# Altium schematic sheet HIVE_SIGHT_WROOM.SchDoc
size Tabloid; Sheet_Name: WROOM; Size: 11x17
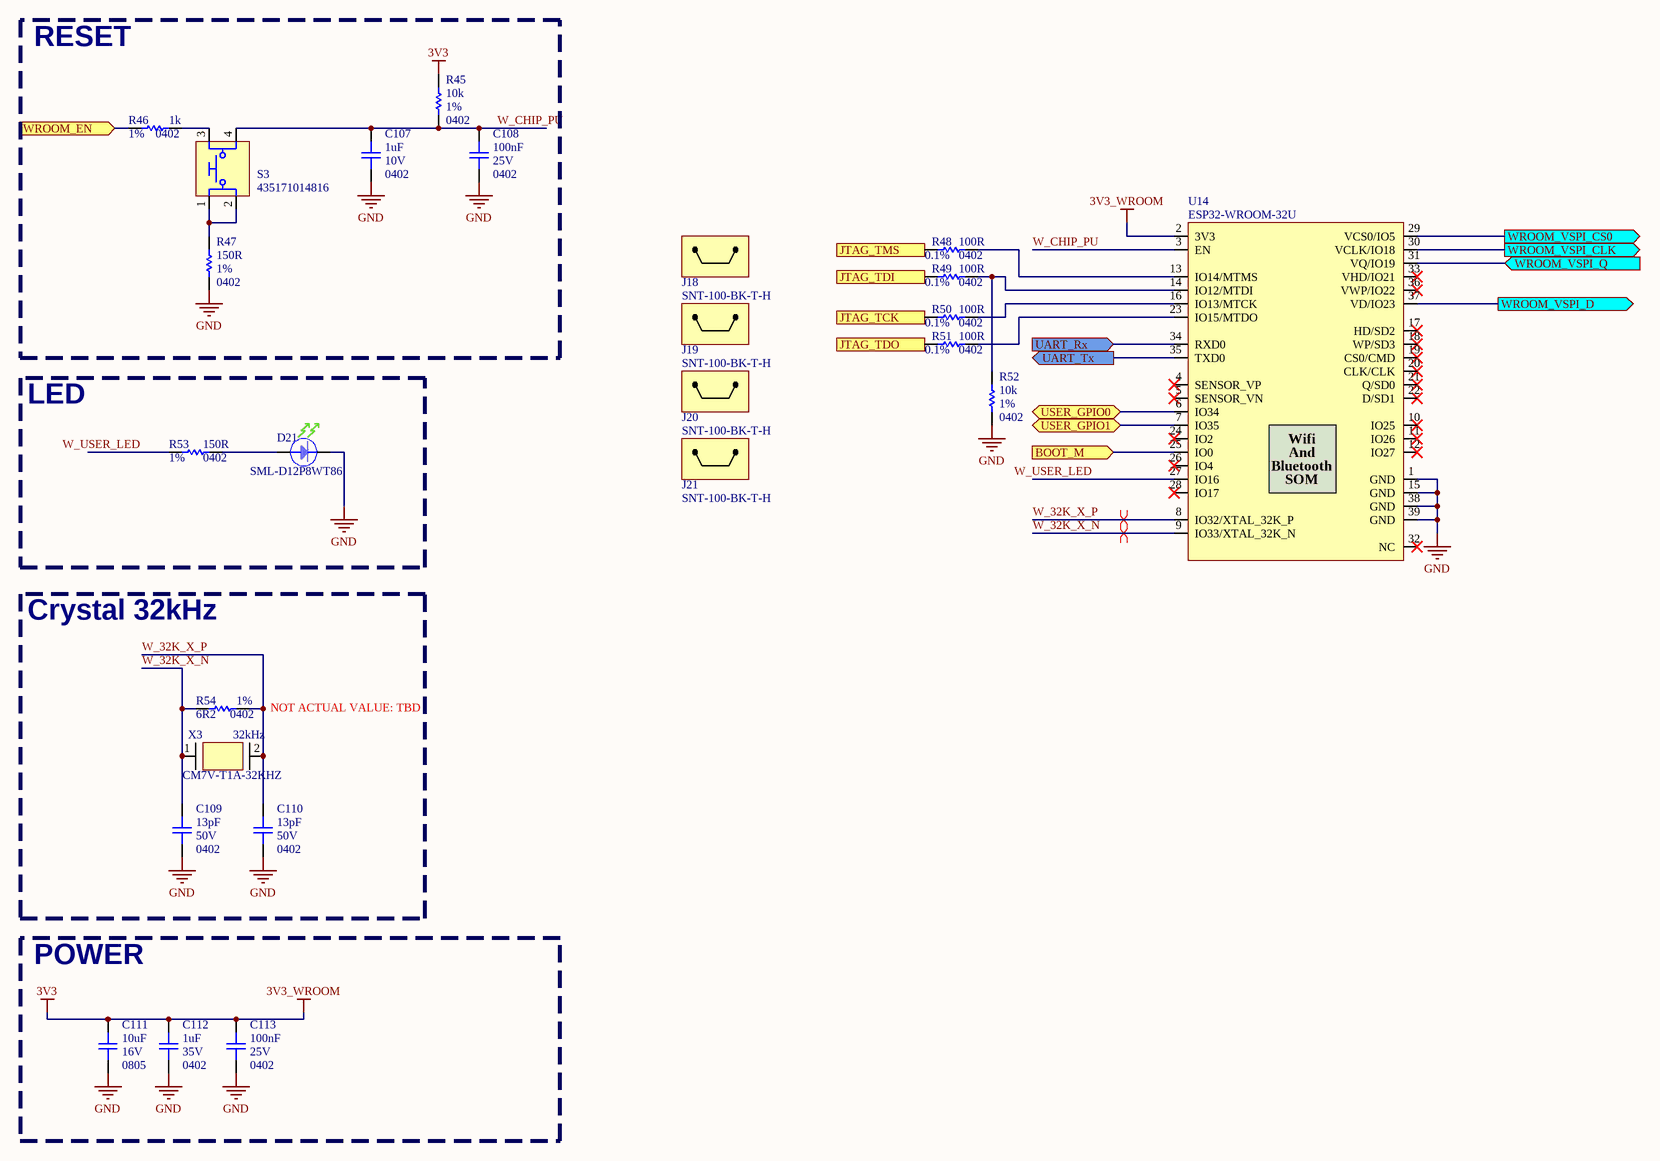
[diagram p0: HIVE_SIGHT_WROOM.SchDoc]

## Parts
C107  value 1uF  Package: 0402  Voltage Rating: 10V  [CAP_CER_0402]  (hidden comment: CL05A105MP5NNNC)
C108  value 100nF  Package: 0402  Voltage Rating: 25V  [CAP_CER_0402]  (hidden comment: CL05A104KA5NNNC)
C109  value 13pF  Package: 0402  Voltage Rating: 50V  [CAP_CER_0402]  (hidden comment: CC0402JRNPO9BN130)
C110  value 13pF  Package: 0402  Voltage Rating: 50V  [CAP_CER_0402]  (hidden comment: CC0402JRNPO9BN130)
C111  value 10uF  Package: 0805  Voltage Rating: 16V  [CAP_CER_0805]  (hidden comment: 0805YD106KAT2A)
C112  value 1uF  Package: 0402  Voltage Rating: 35V  [CAP_CER_0402]  (hidden comment: CL05A105KL5NRNC)
C113  value 100nF  Package: 0402  Voltage Rating: 25V  [CAP_CER_0402]  (hidden comment: CL05A104KA5NNNC)
D21  SML-D12P8WT86  [LED_SML-D12P8WT86]
J18  SNT-100-BK-T-H  [CON_JMP_SNT-100-BK-T-H]
J19  SNT-100-BK-T-H  [CON_JMP_SNT-100-BK-T-H]
J20  SNT-100-BK-T-H  [CON_JMP_SNT-100-BK-T-H]
J21  SNT-100-BK-T-H  [CON_JMP_SNT-100-BK-T-H]
R45  value 10k  Tolerance: 1%  Package: 0402  [RES_0402]  (hidden comment: RC0402FR-0710KL)
R46  value 1k  Tolerance: 1%  Package: 0402  [RES_0402]  (hidden comment: RC0402FR-071KL)
R47  value 150R  Tolerance: 1%  Package: 0402  [RES_0402]  (hidden comment: RC0402FR-07150RL)
R48  value 100R  Tolerance: 0.1%  Package: 0402  [RES_0402]  (hidden comment: PNM0402E1000BST1)
R49  value 100R  Tolerance: 0.1%  Package: 0402  [RES_0402]  (hidden comment: PNM0402E1000BST1)
R50  value 100R  Tolerance: 0.1%  Package: 0402  [RES_0402]  (hidden comment: PNM0402E1000BST1)
R51  value 100R  Tolerance: 0.1%  Package: 0402  [RES_0402]  (hidden comment: PNM0402E1000BST1)
R52  value 10k  Tolerance: 1%  Package: 0402  [RES_0402]  (hidden comment: RC0402FR-0710KL)
R53  value 150R  Tolerance: 1%  Package: 0402  [RES_0402]  (hidden comment: RC0402FR-07150RL)
R54  value 6R2  Tolerance: 1%  Package: 0402  [RES_0402]  (hidden comment: RC0402FR-076R2L)
S3  435171014816  [SWI_TACT_435171014816]
U14  ESP32-WROOM-32U  [COM_ESP32-WROOM-32U(8MB)]
X3  CM7V-T1A-32KHZ  value 32kHz  [CRY_CM7V-T1A-32.768KHZ-12.5PF-20PPM-TA-QC]

## Blocks framed on the sheet
RESET: C107 C108 R45-R47 S3
LED: D21 R53
Crystal 32kHz: C109 C110 R54 X3
POWER: C111-C113

## Ports
BOOT_M (in), JTAG_TCK (in), JTAG_TDI (in), JTAG_TDO (in), JTAG_TMS (in), UART_Rx (in), UART_Tx (out), USER_GPIO0 (bidir), USER_GPIO1 (bidir), WROOM_EN (in), WROOM_VSPI_CLK (out), WROOM_VSPI_CS0 (out), WROOM_VSPI_D (out), WROOM_VSPI_Q (in)

## Nets
3V3: C111.2 C112.2 C113.2 R45.2 U14.2(3V3)  [also labelled 3V3_WROOM]
GND: C107.1 C108.1 C109.1 C110.1 C111.1 C112.1 C113.1 D21.K R47.1 R52.1 U14.1(GND) U14.15(GND) U14.38(GND) U14.39(GND)
BOOT_M: U14.25(IO0) ; port BOOT_M
JTAG_TCK: R50.2 ; port JTAG_TCK
JTAG_TDI: R49.2 ; port JTAG_TDI
JTAG_TDO: R51.2 ; port JTAG_TDO
JTAG_TMS: R48.2 ; port JTAG_TMS
UART_Rx: U14.34(RXD0) ; port UART_Rx
UART_Tx: U14.35(TXD0) ; port UART_Tx
USER_GPIO0: U14.6(IO34) ; port USER_GPIO0
USER_GPIO1: U14.7(IO35) ; port USER_GPIO1
W_32K_X_N: C109.2 R54.2 U14.9(IO33/XTAL_32K_N) X3.1(In/Out)
W_32K_X_P: C110.2 R54.1 U14.8(IO32/XTAL_32K_P) X3.2(Out/In)
W_CHIP_PU: C107.2 C108.2 R45.1 S3.4 U14.3(EN)
W_USER_LED: R53.2 U14.27(IO16)
WROOM_EN: R46.2 ; port WROOM_EN
WROOM_VSPI_CLK: U14.30(VCLK/IO18) ; port WROOM_VSPI_CLK
WROOM_VSPI_CS0: U14.29(VCS0/IO5) ; port WROOM_VSPI_CS0
WROOM_VSPI_D: U14.37(VD/IO23) ; port WROOM_VSPI_D
WROOM_VSPI_Q: U14.31(VQ/IO19) ; port WROOM_VSPI_Q
NetD21_A: D21.A R53.1
NetR46_1: R46.1 S3.3
NetR47_2: R47.2 S3.1 S3.2
NetR48_1: R48.1 U14.13(IO14/MTMS)
NetR49_1: R49.1 R52.2 U14.14(IO12/MTDI)
NetR50_1: R50.1 U14.16(IO13/MTCK)
NetR51_1: R51.1 U14.23(IO15/MTDO)

Not connected (* = marked no-connect by the designer): U14 4(SENSOR_VP)* 5(SENSOR_VN)* 10(IO25)* 11(IO26)* 12(IO27)* 17(HD/SD2)* 18(WP/SD3)* 19(CS0/CMD)* 20(CLK/CLK)* 21(Q/SD0)* 22(D/SD1)* 24(IO2)* 26(IO4)* 28(IO17)* 32(NC)* 33(VHD/IO21)* 36(VWP/IO22)*

## Layout directives
differential pair: W_32K_X_N, W_32K_X_P

## Notes on the sheet
- NOT ACTUAL VALUE: TBD
- Sheet Name
- Project Title
- Global Project
- Size
- Group
- Revision
- Date
- Sheet
- of
- Filename
- Designers
- (in symbol COM_ESP32-WROOM-32U(8MB)) Wifi; And; Bluetooth; SOM

## Library data of the parts
C107 = CAP_CER_CL05A105MP5NNNC: CAP - CER 1uF 20% 10V X5R - 0402; Manufacturer #1: Samsung Electro-Mechanics; GRAMS Lib Spec: 2.8; Magnetic Material: YES; Polarized: NO; Cryo: UNKNOWN; Assembly Type: SMD; CreatedBy/Date: Jonathan Bouchard 2018-07-05; Current Rating: *; HelpURL: http://www.samsungsem.com/kr/support/product-search/mlcc/__icsFiles/afieldfile/2018/06/19/CL05A105MP5NNNC.pdf; Manufacturer #2: *; Note: *; Part Number #1: CL05A105MP5NNNC; Part Number #2: *; Power Max: *; Temperature: -55°C ~ 85°C; Tolerance: 20%; VerifiedBy: Arnaud Samson 16-07-18; Supplier 1: Digi-Key; Supplier Part Number 1: 1276-1448-1-ND
C108 C113 = CAP_CER_CL05A104KA5NNNC: CAP - CER 0.1uF 10% 25V X5R - 0402; Manufacturer #1: Samsung Electro-Mechanics; GRAMS Lib Spec: 2.8; Magnetic Material: Unknown; Polarized: NO; Assembly Type: SMD; CreatedBy/Date: Keven Deslandes - 2018/09/26; Current Rating: *; HelpURL: http://www.samsungsem.com/kr/support/product-search/mlcc/CL05A104KA5NNNC.jsp; Manufacturer #2: *; Note: *; Part Number #1: CL05A104KA5NNNC; Part Number #2: *; Power Max: *; Temperature: -55°C ~ 85°C; Tolerance: 10%; VerifiedBy: Nicolas Roy - 2018/12/11; Supplier 1: Digi-Key; Supplier Part Number 1: 1276-1043-1-ND; Cryo: UNKNOWN
C109 C110 = CAP_CER_CC0402JRNPO9BN130: CAP - CER 13PF 50V C0G/NP0 - 0402; Manufacturer #1: Yageo; Tolerance: ±5%; GRAMS Lib Spec: 2.8; Magnetic Material: Unknown; Polarized: NO; Current Rating: *; Power Max: *; HelpURL: https://www.yageo.com/upload/media/product/productsearch/datasheet/mlcc/UPY-GP_NP0_16V-to-50V_18.pdf; CreatedBy/Date: Hubert Dube - 04/10/20; VerifiedBy: Louis-Daniel Gaulin - 09/11/2020; Temperature: -55°C ~ 125°C; Manufacturer #2: *; Assembly Type: SMD; Part Number #2: *; Part Number #1: CC0402JRNPO9BN130; Cryo: UNKNOWN; Supplier 1: Digi-Key; Supplier Part Number 1: 311-3754-1-ND
C111 = CAP_CER_0805YD106KAT2A: CAP - CER 10UF 16V X5R - 0805; Manufacturer #1: AVX Corporation; GRAMS Lib Spec: 2.8; Tolerance: 10%; Magnetic Material: Unknown; Polarized: No; Assembly Type: SMD; CreatedBy/Date: L-P Gauthier / 2018-05-29; Current Rating: *; HelpURL: http://datasheets.avx.com/cx5r.pdf; Manufacturer #2: *; Part Number #1: 0805YD106KAT2A; Part Number #2: *; Power Max: *; Temperature: -55°C ~ 85°C; VerifiedBy: Caroline Paulin - 27 sept 2018; Supplier 1: Digi-Key; Supplier Part Number 1: 478-5165-1-ND; Cryo: UNKNOWN
C112 = CAP_CER_CL05A105KL5NRNC: CAP - CER 1uF 10% 35V X5R - 0402; Manufacturer #1: Samsung Electro-Mechanics; GRAMS Lib Spec: 2.8; Magnetic Material: Unknown; Polarized: NO; Assembly Type: SMD; CreatedBy/Date: Nicolas Roy 2018-10-03; Current Rating: *; HelpURL: http://www.samsungsem.com/kr/support/product-search/mlcc/__icsFiles/afieldfile/2018/06/19/CL05A105KL5NRNC.pdf; Manufacturer #2: *; Part Number #1: CL05A105KL5NRNC; Part Number #2: *; Power Max: *; Temperature: -55°C ~ 85°C; Tolerance: 10%; VerifiedBy: Caroline Paulin - 18 janv 2019; Supplier 1: Digi-Key; Supplier Part Number 1: 1276-6796-1-ND; Cryo: UNKNOWN
D21 = LED_SML-D12P8WT86: LED - GREEN DIFFUSED 0603 SMD - 0603; Manufacturer #1: Rohm Semiconductor; Current Rating: 1-20mA; Note: Operate at 2mA; Value: 560 nm (green); Voltage rating: 2.2V (Forward), 5V (max Reverse); Polarized: Yes; Magnetic Material: Unknown; GRAMS Lib Spec: 2.8; Manufacturer #2: *; Power Max: *; Part Number #1: SML-D12P8WT86; Part Number #2: *; HelpURL: https://d1d2qsbl8m0m72.cloudfront.net/en/products/databook/datasheet/opto/led/chip_mono/sml-d12x8_d13x8-e.pdf; Supplier 1: Digi-Key; Supplier Part Number 1: 511-1579-2-ND; Assembly Type: SMD; Temperature: -40 ~ 85 °C; Package: 0603; CreatedBy/Date: Keven Deslandes - 2018/11/21; Tolerance: *; VerifiedBy: Caroline Paulin - 13 février 2019; Cryo: UNKNOWN
J18-J21 = CON_JMP_SNT-100-BK-T-H: CON - CONN SHUNT - MEC; Manufacturer #1: Samtec Inc.; Voltage Rating: 450 VAC; Current Rating: 4.3A; GRAMS Lib Spec: 2.8; Magnetic Material: UNKNOWN; Polarized: NO; Value: *; Tolerance: *; Power Max: *; HelpURL: http://suddendocs.samtec.com/catalog_english/snt.pdf; CreatedBy/Date: Arnaud Samson - 09/07/18; VerifiedBy: Jonathan Bouchard 2018-07-12; Temperature: -55 °C to +125 °C; Package: MEC; Manufacturer #2: *; Note: *; Assembly Type: MANUAL; Part Number #2: *; Part Number #1: SNT-100-BK-T-H; Supplier 1: Digi-Key; Supplier Part Number 1: SAM8972-ND
R45 R52 = RES_RC0402FR-0710KL: RES - 10K OHMS 1% 1/16W - 0402; Manufacturer #1: Yageo; GRAMS Lib Spec: 2.8; Magnetic Material: UNKNOWN; Polarized: NO; Voltage Rating: 50V; Assembly Type: SMD; CreatedBy/Date: Nicolas V. (2018-11-20); Current Rating: *; HelpURL: http://www.yageo.com/documents/recent/PYu-RC_Group_51_RoHS_L_9.pdf; Manufacturer #2: *; Note: *; Part Number #1: RC0402FR-0710KL; Part Number #2: *; Power Max: 1/16W; Temperature: -55°C ~ 155°C; VerifiedBy: Nicolas V. (2018-11-20); Supplier 1: Digi-Key; Supplier Part Number 1: 311-10.0KLRCT-ND; Cryo: UNKNOWN
R46 = RES_RC0402FR-071KL: RES - 1K OHM 1% 1/16W - 0402; Manufacturer #1: Yageo; GRAMS Lib Spec: 2.8; Magnetic Material: YES; Polarized: NO; Voltage Rating: 50V; Cryo: UNKNOWN; Assembly Type: SMD; CreatedBy/Date: Jonathan Bouchard 2018-07-05; Current Rating: *; HelpURL: http://www.yageo.com/documents/recent/PYu-RC_Group_51_RoHS_L_9.pdf; Manufacturer #2: *; Note: *; Part Number #1: RC0402FR-071KL; Part Number #2: *; Power Max: 1/16W; Temperature: -55°C ~ 155°C; VerifiedBy: Arnaud Samson 16-07-18; Supplier 1: Digi-Key; Supplier Part Number 1: 311-1.00KLRCT-ND
R47 R53 = RES_RC0402FR-07150RL: RES - 150R 1% 1/16W - 0402; Manufacturer #1: Yageo; GRAMS Lib Spec: 2.8; Magnetic Material: Unknown; Polarized: No; Voltage Rating: 50V; Assembly Type: SMD; CreatedBy/Date: Jonathan Bouchard 2019-03-25; Current Rating: *; HelpURL: http://www.yageo.com/documents/recent/PYu-RC_Group_51_RoHS_L_10.pdf; Manufacturer #2: *; Part Number #1: RC0402FR-07150RL; Part Number #2: *; Power Max: 1/16W; Temperature: -55°C ~ 155°C; VerifiedBy: Nicolas V. (2019-05-02); Supplier 1: Digi-Key; Supplier Part Number 1: 311-150LRCT-ND; Cryo: UNKNOWN
R48-R51 = RES_NOMAG_PNM0402E1000BST1: RES - 100 OHM 0.1% 1/20W NON-MAG - 0402; Manufacturer #1: Vishay Dale; GRAMS Lib Spec: 2.8; Magnetic Material: NO; Voltage Rating: 75V; Cryo: UNKNOWN; Assembly Type: SMD; CreatedBy/Date: Jonathan Bouchard 2018-04-3; Current Rating: *; HelpURL: http://www.vishay.com/docs/60057/pnm.pdf; Manufacturer #2: *; Note: *; Part Number #1: PNM0402E1000BST1; Part Number #2: *; Power Max: 1/20W; Temperature: -55°C ~ 155°C; VerifiedBy: Arnaud Samson 17-07-18; Polarized: No; Supplier 1: Digi-Key; Supplier Part Number 1: 541-1899-1-ND
R54 = RES_RC0402FR-076R2L: RES - 6.2R 1% 1/16W - 0402; Manufacturer #1: Yageo; Part Number #1: RC0402JR-076R2L; GRAMS Lib Spec: 2.8c; Magnetic Material: Unknown; Polarized: No; Voltage Rating: 50V; Assembly Type: SMD; CreatedBy/Date: Hubert Dubé 04/10/2020; Current Rating: *; HelpURL: https://www.yageo.com/upload/media/product/productsearch/datasheet/rchip/PYu-RC_Group_51_RoHS_L_11.pdf; Manufacturer #2: *; Note: *; Part Number #2: *; Power Max: 1/16W; Temperature: -55°C ~ 155°C; VerifiedBy: Louis-Daniel Gaulin - 09/11/2020; Supplier 1: Digi-Key; Supplier Part Number 1: 13-RC0402FR-076R2LCT-ND
S3 = SWI_TACT_435171014816: SWI - SWITCH TACTILE SPST-NO 0.05A 12V -SMD; Manufacturer #1: Würth Elektronik; Current Rating: 50mA; Voltage rating: 12VDC; Polarized: No; Magnetic Material: UNKNOWN; GRAMS Lib Spec: 2.8; Manufacturer #2: *; Power Max: *; Value: SPST-NO; Part Number #1: 435171014816; Part Number #2: *; HelpURL: https://www.we-online.com/catalog/datasheet/435171014816.pdf; Supplier 1: Digi-Key; Supplier Part Number 1: 732-435171014816CT-ND; Assembly Type: SMD; Temperature: -40°C ~ 85°C; Package: SMD; CreatedBy/Date: Hubert Dube - 22/07/20; Tolerance: *; VerifiedBy: Louis-Daniel Gaulin / 12-11-2020; Cryo: UNKNOWN
U14 = COM_ESP32-WROOM-32U(8MB): Bluetooth, WiFi 802.11b/g/n, Bluetooth v4.2  2.4GHz ~ 2.5GHz U.FL Surface Mount; Manufacturer #1: Espressif Systems; Part Number #1: 1904-1027-1-ND; Voltage Rating: -0.3 to 3.6V; Current Rating: 1100mA; Power Max: 3.96W; GRAMS Lib Spec: 2.7; Note: Antenna not included; Magnetic Material: Unknown; Polarized: Yes; Value: *; Tolerance: *; HelpURL: https://www.espressif.com/sites/default/files/documentation/esp32-wroom-32d_esp32-wroom-32u_datasheet_en.pdf; VerifiedBy: Philippe Arsenault - 15/12/2020; Temperature: -40~150C; Package: 38-SMD MODULE; Manufacturer #2: *; Assembly Type: SMD; Part Number #2: *; CreatedBy/Date: Hubert Dube -  12/12/20; Supplier 1: Digi-Key; Supplier Part Number 1: 1904-1027-1-ND
X3 = CRY_CM7V-T1A-32.768KHZ-12.5PF-20PPM-TA-QC: CRY - 32.768KHZ tol:20ppm 12.5PF - 2-SMD; Manufacturer #1: Micro Crystal AG; Magnetic Material: Unknown; Polarized: No; GRAMS Lib Spec: 2.8; Tolerance: ±20ppm; Assembly Note: DNI; Assembly Type: SMD; Current Rating: *; Manufacturer #2: *; Note: *; Part Number #1: CM7V-T1A-32.768KHZ-12.5PF-20PPM-TA-QC; Part Number #2: *; Package: 2-SMD, No Lead; Power Max: *; Voltage rating: *; Temperature: -40°C ~ 85°C; HelpURL: https://www.microcrystal.com/fileadmin/Media/Products/32kHz/Datasheet/CM7V-T1A.pdf; CreatedBy/Date: Hubert Dube - 21/07/20; VerifiedBy: Louis-Daniel Gaulin - 09/11/2020; Cryo: UNKNOWN; Supplier 1: Digi-Key; Supplier Part Number 1: 2195-CM7V-T1A-32.768KHZ-12.5PF-20PPM-TA-QCCT-ND